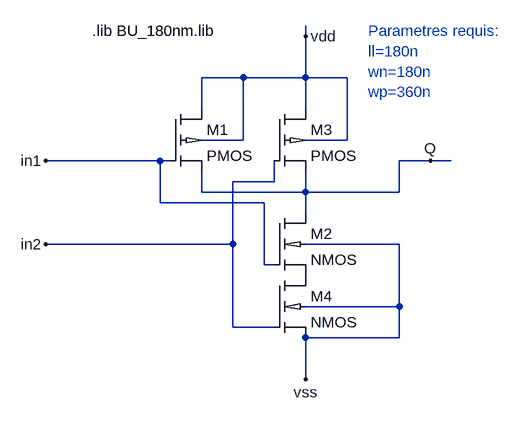
[diagram p0: schematic nand.asc]
nand.asc, the LTspice schematic file:
Version 4
SHEET 1 1192 788
WIRE 448 176 448 160
WIRE 352 240 288 240
WIRE 448 240 448 176
WIRE 448 240 352 240
WIRE 512 240 448 240
WIRE 288 288 288 240
WIRE 448 288 448 240
WIRE 352 336 352 240
WIRE 352 336 288 336
WIRE 512 336 512 240
WIRE 512 336 448 336
WIRE 224 368 48 368
WIRE 240 368 224 368
WIRE 640 368 592 368
WIRE 672 368 640 368
WIRE 400 400 400 368
WIRE 400 400 336 400
WIRE 288 416 288 384
WIRE 448 416 448 384
WIRE 448 416 288 416
WIRE 592 416 592 368
WIRE 592 416 448 416
WIRE 224 432 224 368
WIRE 384 432 224 432
WIRE 448 448 448 416
WIRE 336 496 336 400
WIRE 336 496 48 496
WIRE 592 496 448 496
WIRE 384 528 384 432
WIRE 400 528 384 528
WIRE 592 592 592 496
WIRE 592 592 448 592
WIRE 336 624 336 496
WIRE 400 624 336 624
WIRE 592 640 592 592
WIRE 592 640 448 640
WIRE 448 704 448 640
FLAG 448 176 vdd
FLAG 448 704 vss
FLAG 640 368 Q
FLAG 48 368 in1
FLAG 48 496 in2
SYMBOL pmos018 240 288 R0
SYMATTR InstName M1
SYMATTR Value2 l={ll} w={wp} ad={450n*{wp}} as={450n*{wp}} pd={900n+{wp}} ps={1080n+{wp}}
SYMBOL nmos018 400 448 R0
SYMATTR InstName M2
SYMATTR Value2 l={ll} w={wn} ad={450n*{wn}} as={450n*{wn}} pd={900n+{wn}} ps={1080n+{wn}}
SYMBOL pmos018 400 288 R0
SYMATTR InstName M3
SYMATTR Value2 l={ll} w={wp} ad={450n*{wp}} as={450n*{wp}} pd={900n+{wp}} ps={1080n+{wp}}
SYMBOL nmos018 400 544 R0
SYMATTR InstName M4
SYMATTR Value2 l={ll} w={wn} ad={450n*{wn}} as={450n*{wn}} pd={900n+{wn}} ps={1080n+{wn}}
TEXT 120 168 Left 2 !.lib BU_180nm.lib
TEXT 544 168 Left 2 ;Parametres requis: \nll=180n\nwn=180n \nwp=360n

The netlist it stands for:
* nand.asc
M1 vdd in1 Q vdd PMOS l={ll} w={wp} ad={450n*{wp}} as={450n*{wp}} pd={900n+{wp}} ps={1080n+{wp}}
M2 Q in1 P001 vss NMOS l={ll} w={wn} ad={450n*{wn}} as={450n*{wn}} pd={900n+{wn}} ps={1080n+{wn}}
M3 vdd in2 Q vdd PMOS l={ll} w={wp} ad={450n*{wp}} as={450n*{wp}} pd={900n+{wp}} ps={1080n+{wp}}
M4 P001 in2 vss vss NMOS l={ll} w={wn} ad={450n*{wn}} as={450n*{wn}} pd={900n+{wn}} ps={1080n+{wn}}
.model NMOS NMOS
.model PMOS PMOS
.lib standard.mos
.lib BU_180nm.lib
* Parametres requis:
* ll=180n
* wn=180n
* wp=360n
.lib BU_180nm.lib
.backanno
.end